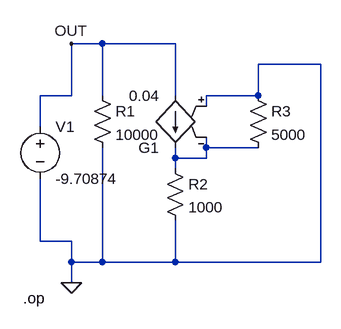
[diagram p0: schematic Q8.asc]
Q8.asc, the LTspice schematic file:
Version 4
SHEET 1 880 680
WIRE 208 32 160 32
WIRE 320 32 208 32
WIRE 544 64 448 64
WIRE 160 112 160 32
WIRE 160 112 112 112
WIRE 208 112 208 32
WIRE 320 112 320 32
WIRE 448 112 448 64
WIRE 448 112 368 112
WIRE 368 128 368 112
WIRE 112 160 112 112
WIRE 368 192 368 176
WIRE 448 192 368 192
WIRE 320 208 320 192
WIRE 368 208 368 192
WIRE 368 208 320 208
WIRE 320 224 320 208
WIRE 112 336 112 240
WIRE 160 336 112 336
WIRE 160 368 160 336
WIRE 208 368 208 192
WIRE 208 368 160 368
WIRE 320 368 320 304
WIRE 320 368 208 368
WIRE 544 368 544 64
WIRE 544 368 320 368
WIRE 160 400 160 368
FLAG 160 400 0
FLAG 160 32 OUT
SYMBOL res 192 96 R0
SYMATTR InstName R1
SYMATTR Value 10000
SYMBOL res 304 208 R0
SYMATTR InstName R2
SYMATTR Value 1000
SYMBOL res 432 96 R0
SYMATTR InstName R3
SYMATTR Value 5000
SYMBOL g2 320 208 R180
SYMATTR InstName G1
SYMATTR Value 0.04
SYMBOL voltage 112 144 R0
WINDOW 123 0 0 Left 2
WINDOW 39 0 0 Left 2
SYMATTR InstName V1
SYMATTR Value -9.70874
TEXT 86 424 Left 2 !.op

The netlist it stands for:
* Q8.asc
R1 OUT 0 10000
R2 N001 0 1000
R3 0 N001 5000
G1 OUT N001 0 N001 0.04
V1 OUT 0 -9.70874
.op
.backanno
.end